# EAGLE design power electronics2 (EAGLE 9.2.2)
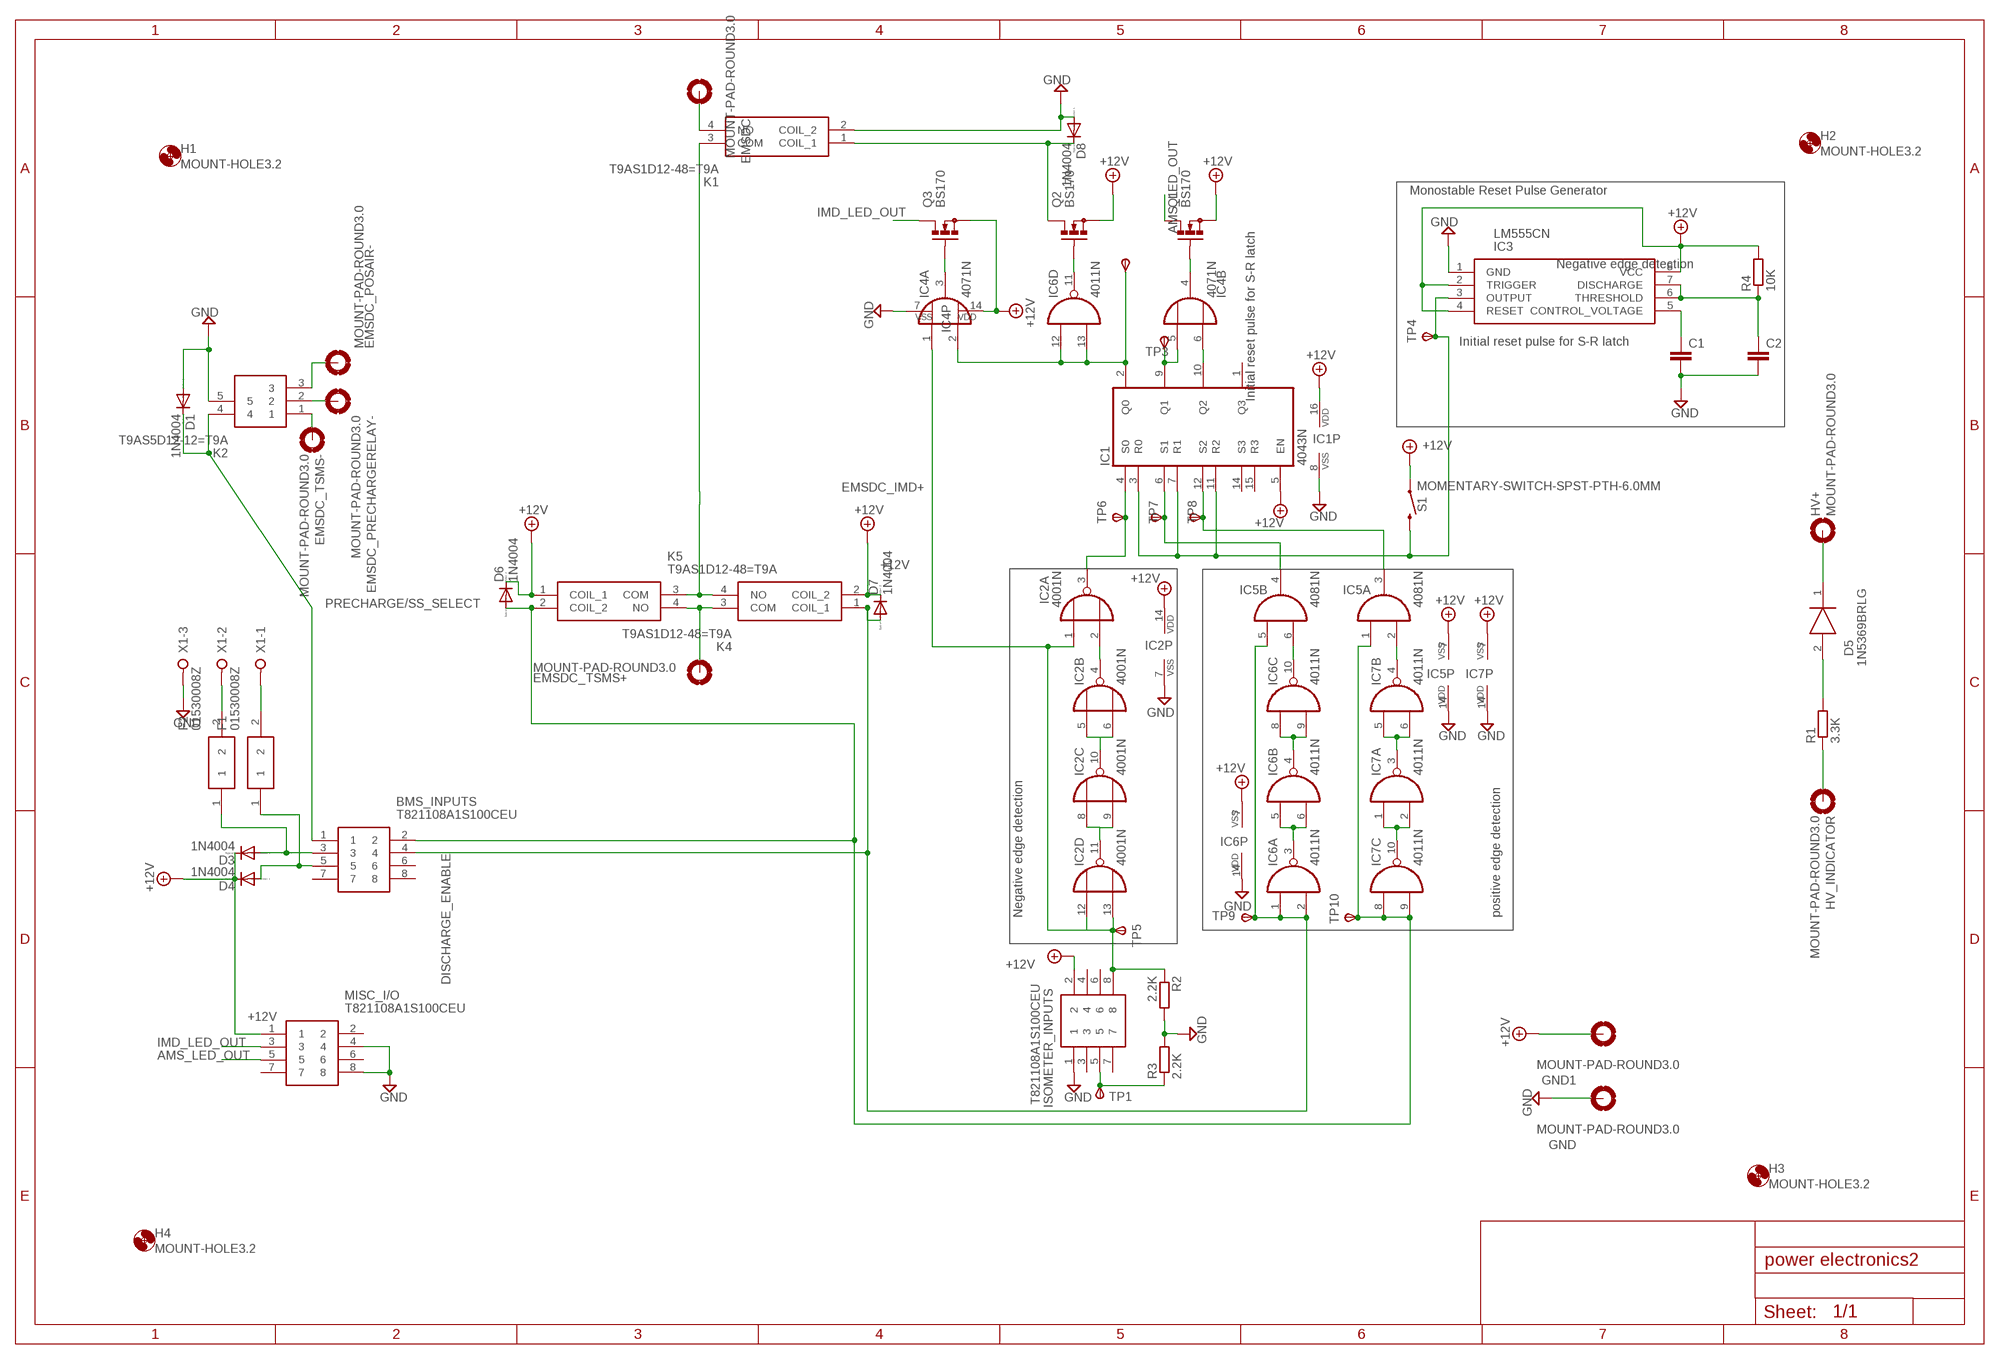
[diagram p0: schematic, sheet 1]

## Parts
BMS_INPUTS  T821108A1S100CEU  [HDRV8W64P254_2X4_1778X895X915P]
C1  C-EU050-024X044  [C050-024X044]
C2  C-EU050-024X044  [C050-024X044]
D1  1N4004  [DO41-10]
D3  1N4004  [DO41-10]
D4  1N4004  [DO41-10]
D5  1N5369BRLG  [DIOAD2260W109L864D349]
D6  1N4004  [DO41-10]
D7  1N4004  [DO41-10]
D8  1N4004  [DO41-10]
EMSDC  MOUNT-PAD-ROUND3.0  [3,0-PAD]
EMSDC_POSAIR-  MOUNT-PAD-ROUND3.0  [3,0-PAD]
EMSDC_PRECHARGERELAY-  MOUNT-PAD-ROUND3.0  [3,0-PAD]
EMSDC_TSMS+  MOUNT-PAD-ROUND3.0  [3,0-PAD]
EMSDC_TSMS-  MOUNT-PAD-ROUND3.0  [3,0-PAD]
F1  01530008Z  [01530008]
F2  01530008Z  [01530008]
GND  MOUNT-PAD-ROUND3.0  [3,0-PAD]
GND1  MOUNT-PAD-ROUND3.0  [3,0-PAD]
H1  MOUNT-HOLE3.2  [3,2]
H2  MOUNT-HOLE3.2  [3,2]
H3  MOUNT-HOLE3.2  [3,2]
H4  MOUNT-HOLE3.2  [3,2]
HV+  MOUNT-PAD-ROUND3.0  [3,0-PAD]
HV_INDICATOR  MOUNT-PAD-ROUND3.0  [3,0-PAD]
IC1  4043N  [DIL16]
IC2  4001N  [DIL14]
IC3  LM555CN  [DIP762W53P254L980H533Q8N]
IC4  4071N  [DIL14]
IC5  4081N  [DIL14]
IC6  4011N  [DIL14]
IC7  4011N  [DIL14]
ISOMETER_INPUTS  T821108A1S100CEU  [HDRV8W64P254_2X4_1778X895X915P]
K1  T9AS1D12-48=T9A  [T9AS1D1248T9A]
K2  T9AS5D12-12=T9A  [T9AS1D12]
K4  T9AS1D12-48=T9A  [T9AS1D1248T9A]
K5  T9AS1D12-48=T9A  [T9AS1D1248T9A]
MISC_I/O  T821108A1S100CEU  [HDRV8W64P254_2X4_1778X895X915P]
Q1  BS170  [SOT54E]
Q2  BS170  [SOT54E]
Q3  BS170  [SOT54E]
R1  3.3K  R-EU_0207/15  [0207/15]
R2  2.2K  R-EU_0207/12  [0207/12]
R3  2.2K  R-EU_0207/12  [0207/12]
R4  10K  R-EU_0207/15  [0207/15]
S1  MOMENTARY-SWITCH-SPST-PTH-6.0MM  [TACTILE_SWITCH_PTH_6.0MM]
TP1  TPSPAD1-17  [P1-17]
TP2  TPSPAD1-17  [P1-17]
TP3  TPSPAD1-17  [P1-17]
TP4  TPSPAD1-17  [P1-17]
TP5  TPSPAD1-17  [P1-17]
TP6  TPSPAD1-17  [P1-17]
TP7  TPSPAD1-17  [P1-17]
TP8  TPSPAD1-17  [P1-17]
TP9  TPSPAD1-17  [P1-17]
TP10  TPSPAD1-17  [P1-17]
X1  W237-3E  [W237-3E]

## Nets
+12V: D3.C D4.C D6.C D7.C GND1.B3,0(MOUNT) IC1.5(EN) IC1.16(VDD) IC2.14(P:VDD) IC3.2(TRIGGER) IC3.4(RESET) IC3.8(VCC) IC4.14(P:VDD) IC5.7(P:VSS) IC6.7(P:VSS) IC7.7(P:VSS) ISOMETER_INPUTS.2 K4.2(COIL_2) K5.1(COIL_1) MISC_I/O.1 Q1.S Q2.S Q3.S R4.2 S1.1
AMS_LED_OUT: MISC_I/O.5 Q1.D
CHG_SAFE: BMS_INPUTS.2 D6.A IC7.9(C:I1) K5.2(COIL_2)
DISCHARGE_ENABLE: BMS_INPUTS.4 D7.A IC5.5(B:I0) IC6.1(A:I0) IC6.2(A:I1) K4.1(COIL_1) TP9.TP(PP)
EMSDC_IMD+: K1.3(COM) K4.4(NO) K5.3(COM)
GND: C1.2 C2.2 D1.A D8.A GND.B3,0(MOUNT) IC1.8(VSS) IC2.7(P:VSS) IC3.1(GND) IC4.7(P:VSS) IC5.14(P:VDD) IC6.14(P:VDD) IC7.14(P:VDD) ISOMETER_INPUTS.1 K1.2(COIL_2) K2.5 MISC_I/O.4 MISC_I/O.8 R2.2 R3.2 X1.3
IMD_LED_OUT: MISC_I/O.3 Q3.D
N$1: EMSDC_TSMS-.B3,0(MOUNT) K2.1
N$2: EMSDC_POSAIR-.B3,0(MOUNT) K2.3
N$3: EMSDC_PRECHARGERELAY-.B3,0(MOUNT) K2.2
N$4: EMSDC_TSMS+.B3,0(MOUNT) K4.3(COM) K5.4(NO)
N$5: D5.1(K) HV+.B3,0(MOUNT)
N$6: BMS_INPUTS.3 D3.A F2.1
N$7: D5.2(A) R1.2
N$8: BMS_INPUTS.5 D4.A F1.1
N$9: HV_INDICATOR.B3,0(MOUNT) R1.1
N$10: ISOMETER_INPUTS.5 R3.1 TP1.TP(PP)
N$11: IC2.1(A:I0) IC2.12(D:I0) IC2.13(D:I1) IC4.1(A:I0) ISOMETER_INPUTS.8 R2.1 TP5.TP(PP)
N$12: IC2.8(C:I0) IC2.9(C:I1) IC2.11(D:O)
N$13: IC2.5(B:I0) IC2.6(B:I1) IC2.10(C:O)
N$14: IC2.2(A:I1) IC2.4(B:O)
N$15: D8.C K1.1(COIL_1) Q2.D
N$16: EMSDC.B3,0(MOUNT) K1.4(NO)
N$17: IC1.4(S0) IC2.3(A:O) TP6.TP(PP)
N$18: C2.1 IC3.6(THRESHOLD) IC3.7(DISCHARGE) R4.1
N$19: C1.1 IC3.5(CONTROL_VOLTAGE)
N$20: IC1.3(R0) IC1.7(R1) IC1.11(R2) IC3.3(OUTPUT) S1.3 TP4.TP(PP)
N$21: IC1.2(Q0) IC4.2(A:I1) IC6.12(D:I0) IC6.13(D:I1) TP2.TP(PP)
N$22: IC1.9(Q1) IC4.5(B:I0) TP3.TP(PP)
N$23: IC1.6(S1) IC5.4(B:O) TP7.TP(PP)
N$24: IC6.3(A:O) IC6.5(B:I0) IC6.6(B:I1)
N$25: IC6.4(B:O) IC6.8(C:I0) IC6.9(C:I1)
N$26: IC5.6(B:I1) IC6.10(C:O)
N$27: IC1.12(S2) IC5.3(A:O) TP8.TP(PP)
N$28: IC5.2(A:I1) IC7.4(B:O)
N$29: IC1.10(Q2) IC4.6(B:I1)
N$30: IC7.3(A:O) IC7.5(B:I0) IC7.6(B:I1)
N$31: F2.2 X1.2
N$32: IC7.1(A:I0) IC7.2(A:I1) IC7.10(C:O)
N$33: F1.2 X1.1
N$34: IC4.4(B:O) Q1.G
N$35: IC4.3(A:O) Q3.G
N$36: IC5.1(A:I0) IC7.8(C:I0) TP10.TP(PP)
N$37: IC6.11(D:O) Q2.G
PRECHARGE/SS_SELECT: BMS_INPUTS.1 D1.C K2.4
Unconnected: BMS_INPUTS.6 BMS_INPUTS.7 BMS_INPUTS.8 IC1.1(Q3) IC1.14(S3) IC1.15(R3) IC4.8(C:I0) IC4.9(C:I1) IC4.10(C:O) IC4.11(D:O) IC4.12(D:I0) IC4.13(D:I1) IC5.8(C:I0) IC5.9(C:I1) IC5.10(C:O) IC5.11(D:O) IC5.12(D:I0) IC5.13(D:I1) IC7.11(D:O) IC7.12(D:I0) IC7.13(D:I1) ISOMETER_INPUTS.3 ISOMETER_INPUTS.4 ISOMETER_INPUTS.6 ISOMETER_INPUTS.7 MISC_I/O.2 MISC_I/O.6 MISC_I/O.7

## Notes on the sheet
- Monostable Reset Pulse Generator
- Negative edge detection
- Initial reset pulse for S-R latch
- Initial reset pulse for S-R latch
- Negative edge detection | positive edge detection

## Library data of the parts
BMS_INPUTS ISOMETER_INPUTS MISC_I/O = SamacSys_Parts:T821108A1S100CEU: HEADER, VERTICAL, 2.54MM, 8WAY Amphenol T821 Series, 2.54mm Pitch 8 Way 2 Row Straight PCB Header, Solder Termination, 3A Source: Datasheet <http://uk.rs-online.com/web/p/products/8323569>; DESCRIPTION: HEADER, VERTICAL, 2.54MM, 8WAY Amphenol T821 Series, 2.54mm Pitch 8 Way 2 Row Straight PCB Header, Solder Termination, 3A; HEIGHT: 9.15mm; MANUFACTURER_NAME: Amphenol; MANUFACTURER_PART_NUMBER: T821108A1S100CEU; RS_PART_NUMBER: 8323569; RS_PRICE-STOCK: http://uk.rs-online.com/web/p/products/8323569
C1 C2 = rcl:C-EU: CAPACITOR, European symbol; SPICEPREFIX: C
D1 D3 D4 D6-D8 = diode:1N4004: DIODE general purpose rectifier, 1 A
D5 = SamacSys_Parts:1N5369BRLG: Zener Diode, 51V 5% 5 W Through Hole 2-pin DO-15 Source: Datasheet <http://uk.rs-online.com/web/p/products/6547678P>; ALLIED_NUMBER: 70339233; DESCRIPTION: Zener Diode, 51V 5% 5 W Through Hole 2-pin DO-15; HEIGHT: mm; MANUFACTURER_NAME: ON Semiconductor; MANUFACTURER_PART_NUMBER: 1N5369BRLG; RS_PART_NUMBER: 6547678P; RS_PRICE-STOCK: http://uk.rs-online.com/web/p/products/6547678P
EMSDC EMSDC_POSAIR- EMSDC_PRECHARGERELAY- EMSDC_TSMS+ EMSDC_TSMS- GND GND1 HV+ HV_INDICATOR = holes:MOUNT-PAD-ROUND: MOUNTING PAD, round
F1 F2 = SamacSys_Parts:01530008Z: Mini fuseholder,15A 32V Littelfuse 15A PCB Mount Fuse Holder Automotive Fuse, 32 V Source: Datasheet <http://www.littelfuse.com/data/en/data_sheets/153_pcmount.pdf>; ALLIED_NUMBER: 70184304; DESCRIPTION: Mini fuseholder,15A 32V Littelfuse 15A PCB Mount Fuse Holder Automotive Fuse, 32 V; HEIGHT: mm; MANUFACTURER_NAME: LITTELFUSE; MANUFACTURER_PART_NUMBER: 01530008Z; RS_PART_NUMBER: 3607317; RS_PRICE-STOCK: https://uk.rs-online.com/web/p/products/3607317
H1-H4 = holes:MOUNT-HOLE: MOUNTING HOLE with drill center marker
IC1 = 40xx:4043: Quad 3-state NOR R/S LATCH
IC2 = 40xx:4001: Quad 2-input NOR
IC3 = SamacSys_Parts:LM555CN: ON Semiconductor LM555CN, Timer, 4.5 16 V, 8-Pin PDIP Source: Datasheet <https://www.mouser.com/datasheet/2/308/LM555-1124984.pdf>; DESCRIPTION: ON Semiconductor LM555CN, Timer, 4.5 16 V, 8-Pin PDIP; HEIGHT: 5.33mm; MANUFACTURER_NAME: ON Semiconductor; MANUFACTURER_PART_NUMBER: LM555CN; MOUSER_PART_NUMBER: 512-LM555CN
IC4 = 40xx:4071: Quad 2-input OR
IC5 = 40xx:4081: Quad 2-input AND
IC6 IC7 = 40xx:4011: Quad 2-input NAND
K1 K4 K5 = SamacSys_Parts:T9AS1D12-48=T9A: SPST-NO PCB Mount Non-Latching Relay Through Hole, 48V dc Source: Datasheet <http://uk.rs-online.com/web/p/products/6802534P>; DESCRIPTION: SPST-NO PCB Mount Non-Latching Relay Through Hole, 48V dc; HEIGHT: 20.4mm; MANUFACTURER_NAME: TE Connectivity; MANUFACTURER_PART_NUMBER: T9AS1D12-48=T9A; RS_PART_NUMBER: 6802534P; RS_PRICE-STOCK: http://uk.rs-online.com/web/p/products/6802534P
K2 = SamacSys_Parts:T9AS5D12-12=T9A: PCB Relay SPDT 30A 12Vdc,thru hole SPDT PCB Mount Non-Latching Relay Through Hole, 12V dc Source: Datasheet; ALLIED_NUMBER: R1111589; DESCRIPTION: PCB Relay SPDT 30A 12Vdc,thru hole SPDT PCB Mount Non-Latching Relay Through Hole, 12V dc; HEIGHT: mm; MANUFACTURER_NAME: TE Connectivity; MANUFACTURER_PART_NUMBER: T9AS5D12-12=T9A; RS_PART_NUMBER: 6802528; RS_PRICE-STOCK: https://uk.rs-online.com/web/p/products/6802528
Q1-Q3 = transistor-small-signal:BS170: N-CHANNEL MOS FET
R1-R4 = rcl:R-EU_: RESISTOR, European symbol; SPICEPREFIX: R
S1 = SparkFun-Switches:MOMENTARY-SWITCH-SPST: Momentary Switch (Pushbutton) - SPST Normally-open (NO) SPST momentary switches (buttons, pushbuttons). Variants PTH-12MM - 12mm square, through-hole Momentary Pushbutton Switch - 12mm Square <https://www.sparkfun.com/products/9190> (COM-09190) PTH-6.0MM, PTH-6.0MM-KIT - 6.0mm square, through-hole Mini Pushbutton Switch <https://www.sparkfun.com/products/97> (COM-00097) KIT package intended for soldering kit's - only one side of pads' copper is exposed. PTH-RIGHT-ANGLE-KIT - Right-angle, through-hole Right Angle Tactile Button <https://www.sparkfun.com/products/10791> - Used on SparkFun BigTime Watch Kit <https://www.sparkfun.com/products/11734> SMD-12MM - 12mm square, surface-mount Tactile Button - SMD (12mm) <https://www.sparkfun.com/products/12993> (COM-12993) Used on SparkFun PicoBoard <https://www.sparkfun.com/products/11888> SMD-4.5MM - 4.5mm Square Trackball Switch Used on SparkFun Blackberry Trackballer Breakout <https://www.sparkfun.com/products/13169> SMD-4.6MMX2.8MM - 4.60mm x 2.80mm, surface mount Used on SparkFun SAMD21 Mini Breakout <https://www.sparkfun.com/products/13664> SMD-5.2MM, SMD-5.2-REDUNDANT - 5.2mm square, surface-mount Mini Pushbutton Switch - SMD <https://www.sparkfun.com/products/8720> (COM-08720) Used on Arduino Pro Mini <https://www.sparkfun.com/products/11114> REDUNDANT package connects both switch circuits together SMD-6.0X3.5MM - 6.0 x 3.5mm, surface mount Momentary Reset Switch SMD <https://www.sparkfun.com/products/8229> (COM-08229) SMD-6.2MM-TALL - 6.2mm square, surface mount Tactile Button - SMD (6mm) <https://www.sparkfun.com/products/12992> Used on SparkFun Digital Sandbox <https://www.sparkfun.com/products/12651> SMD-RIGHT-ANGLE - Right-angle, surface mount Used on SparkFun Block for Intel® Edison - Arduino <https://www.sparkfun.com/products/13036>; PROD_ID: SWCH-08441; SF_SKU: COM-00097
TP1-TP10 = testpad:TPS: TEST PIN
X1 = con-wago-508:W237-3E: WAGO SREW CLAMP; OC_FARNELL: unknown; OC_NEWARK: unknown

## Board
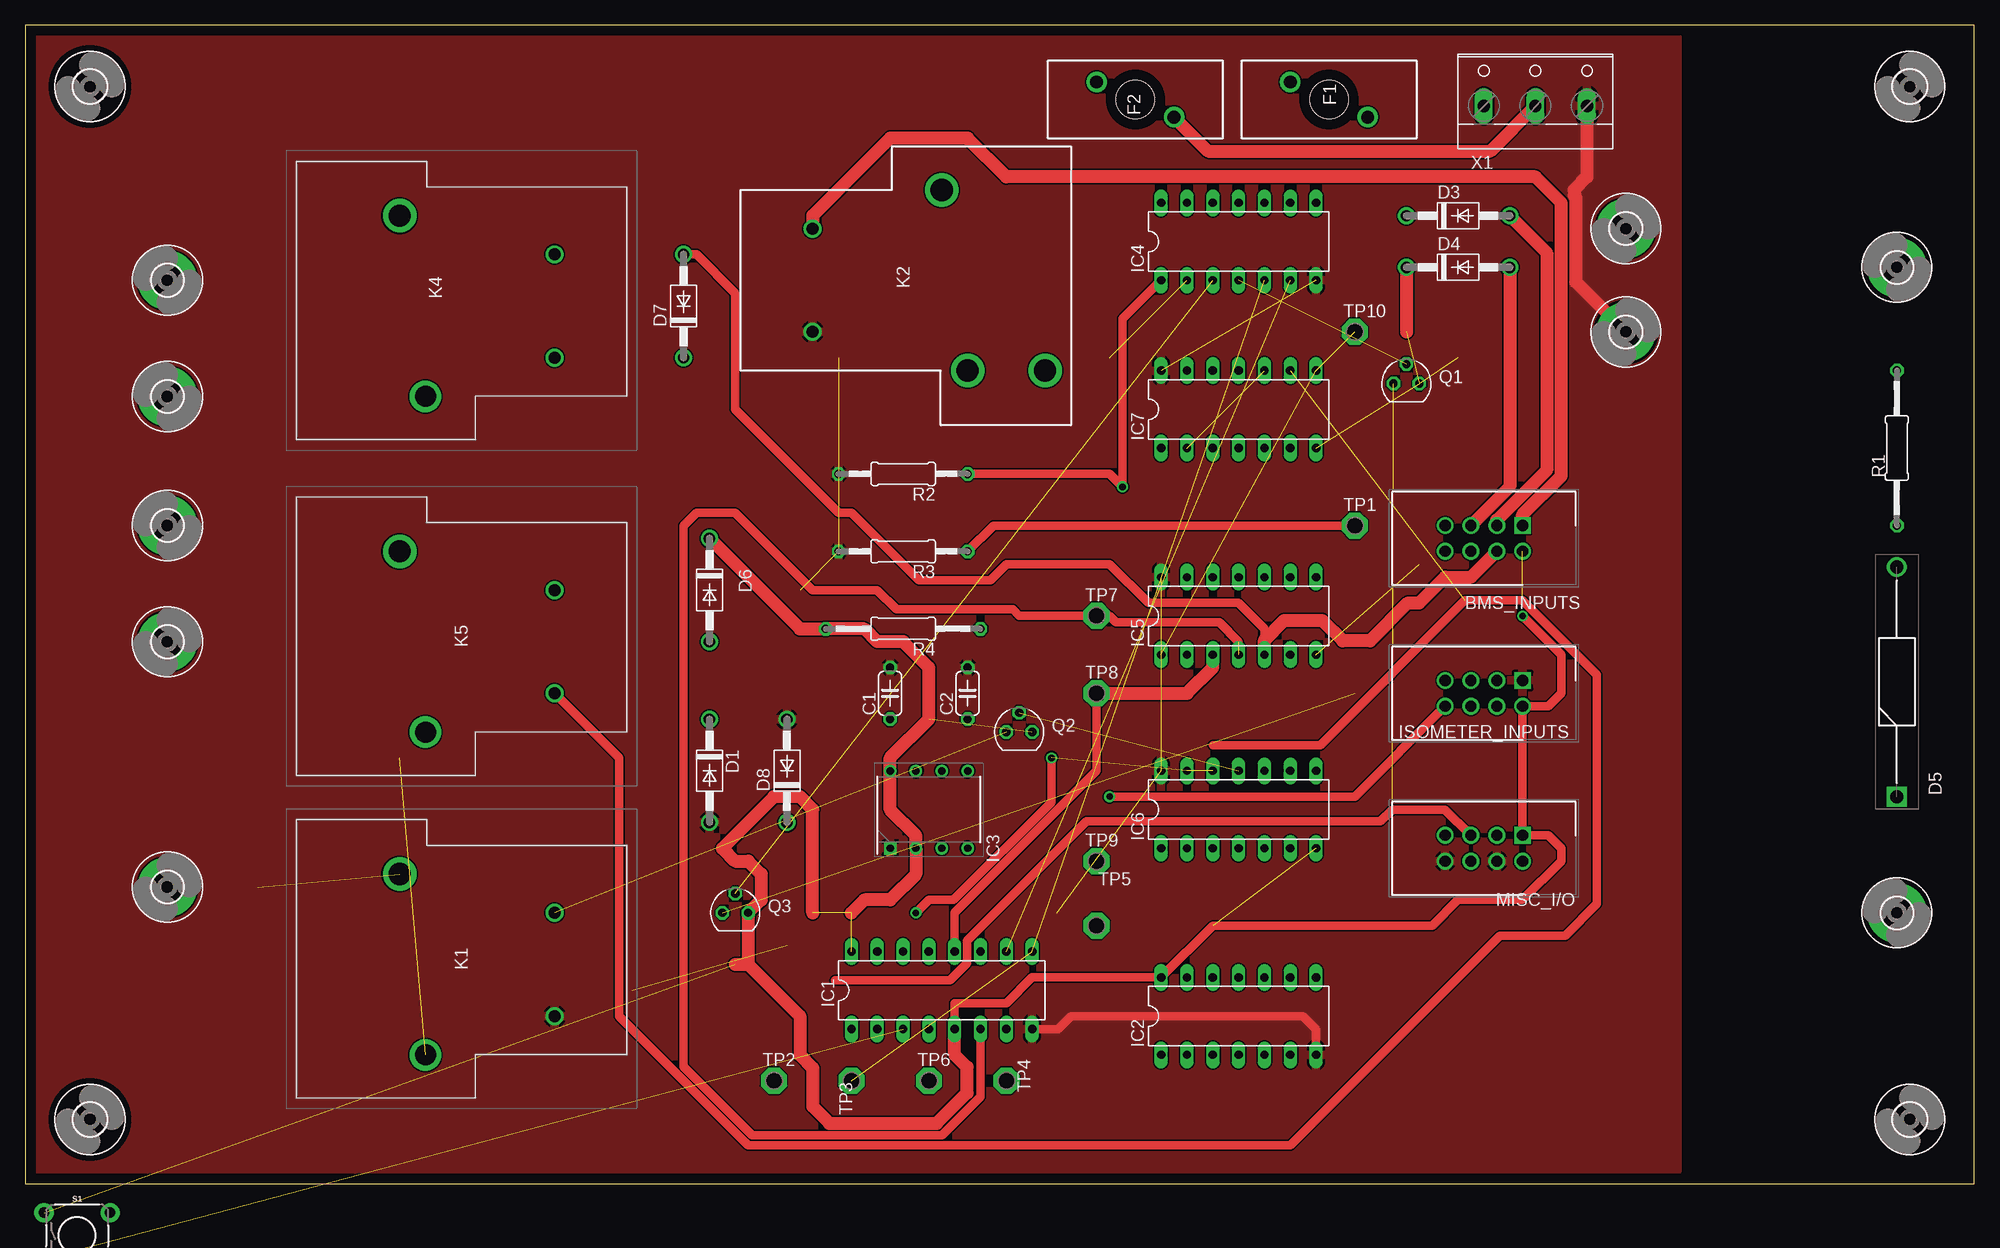
[diagram p1: board, top side]
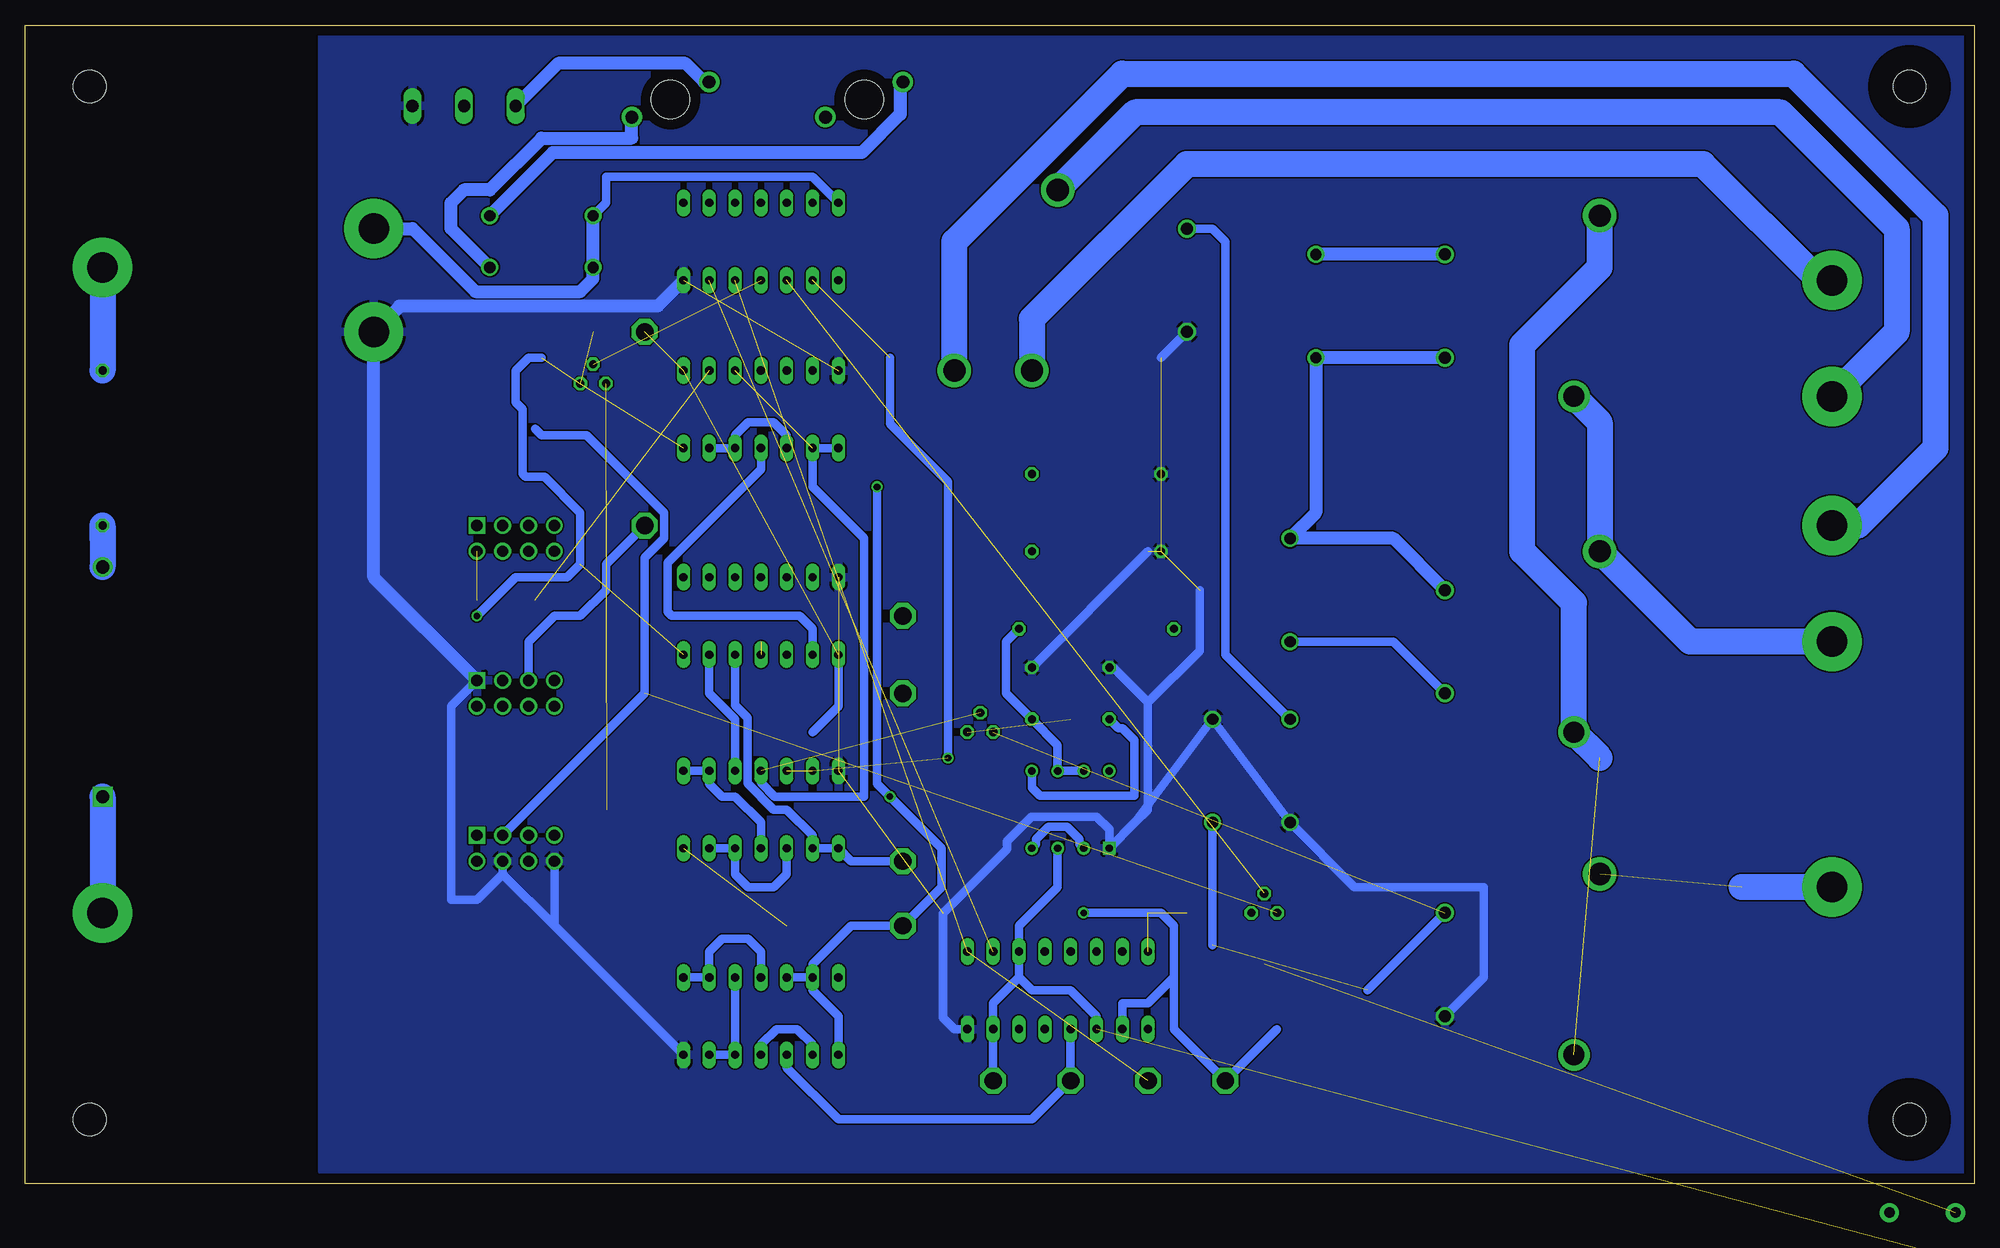
[diagram p2: board, bottom side, seen from below]

Size 191.75 x 113.97 mm. Coordinates in mm from the lower left corner, seen from the top.
Outline: 0,0 191.75,0 191.75,113.97 0,113.97 0,0
Copper layers (1*16): Top 0.035mm / dielectric 1.5mm / Bottom 0.035mm
Design rules "default": minimum track width 6mil, minimum drill 0.35mm, track to track 6mil, track to pad 6mil, pad to pad 6mil, via to via 6mil, smd to smd 6mil, copper to edge 40mil, drill to drill 6mil, minimum pad ring 10mil, minimum via ring 8mil, stop-mask expansion 4mil, vias tented up to drill 0mil, thermal gap 10mil

### Footprints (pad centres in the part's own frame; a part is rotated, then mirrored left to right if it is on the bottom)
HDRV8W64P254_2X4_1778X895X915P = drill 1.1 pad 1.65 square: 1 0,0 | drill 1.1 pad 1.65: 2 0,2.54; 3 2.54,0; 4 2.54,2.54; 5 5.08,0; 6 5.08,2.54; 7 7.62,0; 8 7.62,2.54
C050-024X044 = drill 0.813 octagon: 1 -2.54,0; 2 2.54,0
DO41-10 = drill 1.118: A 5.08,0; C -5.08,0
DIOAD2260W109L864D349 = drill 1.3 pad 1.95 square: 1 0,0 | drill 1.3 pad 1.95: 2 22.6,0
3,0-PAD = drill 3 pad 5.842: B3,0 0,0
01530008 = drill 1.27 pad 2: 1 1.727,3.81; 2 -1.727,-3.81 | hole 3.785: 0,0
3,2 = hole 3.2: 0,0
DIL16 = drill 0.813 long: 1 -8.89,-3.81; 2 -6.35,-3.81; 3 -3.81,-3.81; 4 -1.27,-3.81; 5 1.27,-3.81; 6 3.81,-3.81; 7 6.35,-3.81; 8 8.89,-3.81; 9 8.89,3.81; 10 6.35,3.81; 11 3.81,3.81; 12 1.27,3.81; 13 -1.27,3.81; 14 -3.81,3.81; 15 -6.35,3.81; 16 -8.89,3.81
DIL14 = drill 0.813 long: 1 -7.62,-3.81; 2 -5.08,-3.81; 3 -2.54,-3.81; 4 0,-3.81; 5 2.54,-3.81; 6 5.08,-3.81; 7 7.62,-3.81; 8 7.62,3.81; 9 5.08,3.81; 10 2.54,3.81; 11 0,3.81; 12 -2.54,3.81; 13 -5.08,3.81; 14 -7.62,3.81
DIP762W53P254L980H533Q8N = drill 0.73 pad 1.13 square: 1 -3.81,3.81 | drill 0.73 pad 1.13: 2 -3.81,1.27; 3 -3.81,-1.27; 4 -3.81,-3.81; 5 3.81,-3.81; 6 3.81,-1.27; 7 3.81,1.27; 8 3.81,3.81
T9AS1D1248T9A = drill 1.17 pad 1.755: 1 0,0; 2 -10.16,0 | drill 2.06 pad 3.09: 3 -13.97,12.7 | drill 2.19 pad 3.3: 4 3.81,15.24
T9AS1D12 = drill 2.19 pad 3.29: 1 -8.89,12.7; 2 8.89,15.24; 3 8.89,22.86 | drill 1.17 pad 1.77: 4 -5.08,0; 5 5.08,0
SOT54E = drill 0.813 octagon: D -1.27,0; G 0,1.905; S 1.27,0
0207/15 = drill 0.813 octagon: 1 -7.62,0; 2 7.62,0
0207/12 = drill 0.813 octagon: 1 -6.35,0; 2 6.35,0
TACTILE_SWITCH_PTH_6.0MM = drill 1.016 pad 1.88: 1 -3.251,2.261; 2 3.251,2.261; 3 -3.251,-2.261; 4 3.251,-2.261
P1-17 = drill 1.702 pad 2.54 octagon: TP 0,0
W237-3E = drill 1.194 long: 1 -5.08,-0.635; 2 0,-0.635; 3 5.08,-0.635

### Placement (x,y rotation side)
BMS_INPUTS  147.32,64.77 180 top
C1  85.09,48.26 90 top
C2  92.71,48.26 90 top
D1  67.31,40.64 270 top
D3  140.97,95.25 0 top
D4  140.97,90.17 0 top
D5  184.15,38.1 90 top
D6  67.31,58.42 270 top
D7  64.77,86.36 90 top
D8  74.93,40.64 90 top
EMSDC  13.97,29.21 0 top
EMSDC_POSAIR-  13.97,64.77 270 top
EMSDC_PRECHARGERELAY-  13.97,88.9 270 top
EMSDC_TSMS+  13.97,53.34 0 top
EMSDC_TSMS-  13.97,77.47 270 top
F1  128.27,106.68 270 top
F2  109.22,106.68 90 top
GND  157.48,83.82 0 top
GND1  157.48,93.98 0 top
H1  185.42,6.35 0 top
H2  185.42,107.95 0 top
H3  6.35,6.35 0 top
H4  6.35,107.95 0 top
HV+  184.15,26.67 270 top
HV_INDICATOR  184.15,90.17 90 top
IC1  90.17,19.05 0 top
IC2  119.38,16.51 0 top
IC3  88.9,36.83 90 top
IC4  119.38,92.71 0 top
IC5  119.38,55.88 0 top
IC6  119.38,36.83 0 top
IC7  119.38,76.2 0 top
ISOMETER_INPUTS  147.32,49.53 180 top
K1  52.07,26.67 90 top
K2  77.47,88.9 270 top
K4  52.07,91.44 90 top
K5  52.07,58.42 90 top
MISC_I/O  147.32,34.29 180 top
Q1  135.89,78.74 0 top
Q2  97.79,44.45 0 top
Q3  69.85,26.67 0 top
R1  184.15,72.39 270 top
R2  86.36,69.85 180 top
R3  86.36,62.23 180 top
R4  86.36,54.61 180 top
S1  5.08,-5.08 0 top
TP1  130.81,64.77 0 top
TP2  73.66,10.16 0 top
TP3  81.28,10.16 270 top
TP4  96.52,10.16 90 top
TP5  105.41,25.4 0 top
TP6  88.9,10.16 0 top
TP7  105.41,55.88 0 top
TP8  105.41,48.26 0 top
TP9  105.41,31.75 0 top
TP10  130.81,83.82 0 top
X1  148.59,106.68 0 top

### Tracks (layer width: path | path; a pad name or v marks a point on that pad's centre or on a via)
+12V  (via drill 0.65)  (9 unrouted)
  Top 0.813: v147.32,55.88 151.13,52.07 151.13,48.26 149.86,46.99 ISOMETER_INPUTS.2 MISC_I/O.1 149.86,34.29 151.13,33.02 151.13,31.75 147.32,27.94 140.97,27.94 138.43,25.4 116.84,25.4 IC2.14 99.06,20.32 96.52,17.78 91.44,17.78 IC1.5
  Top 1.27: D4.C 135.89,83.82 | 77.47,26.67 77.47,36.83 76.2,38.1 73.66,38.1 68.58,33.02 69.85,31.75 71.12,31.75 72.39,30.48 72.39,27.94 Q3.S 71.12,21.59 | 81.28,26.67 82.55,27.94 85.09,27.94 87.63,30.48 IC3.2 87.63,34.29 85.09,36.83 IC3.8 85.09,41.91 88.9,45.72 88.9,50.8 86.36,53.34 83.82,53.34 82.55,54.61 R4.2 76.2,54.61 D6.C | 69.85,21.59 71.12,21.59 | 71.12,21.59 76.2,16.51 76.2,12.7 77.47,11.43 77.47,7.62 79.12,5.97 89.68,5.97 92.65,8.95 92.65,11.49 91.44,12.7 IC1.5
  Bottom 0.813: IC3.2 88.03,33.42 88.03,33.91 89.28,35.16 91.06,35.16 92.31,33.91 92.31,33.42 IC3.4 | IC4.14 114.3,99.06 134.62,99.06 134.62,96.52 D3.C | 140.97,81.28 142.24,81.28 143.51,80.01 143.51,76.89 142.82,76.2 142.82,69.85 142.53,69.56 140.68,69.56 137.16,66.04 137.16,60.96 138.43,59.69 143.51,59.69 v147.32,55.88
  Bottom 1.27: K5.1 57.15,63.5 D6.C 64.77,66.04 D7.C K4.2 | GND1.B3,0 153.67,93.98 147.47,87.78 137.16,87.78 135.89,89.05 D4.C D3.C
AMS_LED_OUT  (1 unrouted)
  Top 0.813: 79.68,20.02 90.98,20.02 92.66,21.7 92.66,23.92 104.41,35.67 133.35,35.67 134.51,36.83 139.7,36.83 MISC_I/O.5
CHG_SAFE  (2 unrouted)
  Top 0.813: K5.2 58.42,41.91 58.42,16.51 71.12,3.81 124.46,3.81 145.09,24.43 151.53,24.43 154.63,27.54 154.63,50.1 147.32,57.42 141.66,57.42 127.42,43.18 116.84,43.18
  Bottom 0.813: K5.2 57.15,53.34 D6.A
DISCHARGE_ENABLE
  Top 0.813: D7.A 66.04,91.44 69.85,87.63 69.85,76.2 80.01,66.04 81.28,66.04 87.94,59.38 94.94,59.38 96.52,60.96 106.68,60.96 110.49,57.15 119.38,57.15 121.92,54.61 IC5.5
  Top 1.27: BMS_INPUTS.4 142.24,59.69 139.7,59.69 137.16,57.15 136.06,57.15 132.33,53.42 129.62,53.42 127.6,55.45 123.86,55.45 121.92,53.51 IC5.5
  Bottom 0.813: TP9.TP 110.49,31.75 IC6.1 IC6.2 114.3,34.29 116.84,36.83 118.11,36.83 120.7,39.42 120.7,45.87 121.92,47.09 IC5.5
  Bottom 1.27: K4.1 D7.A
EMSDC_IMD+  (1 unrouted)
  Bottom 2.54: 36.83,41.91 K5.3 39.37,57.15 44.45,62.23 44.45,82.55 36.83,90.17 K4.4
GND  (7 unrouted)
  Top 0.813: IC1.8 101.6,15.24 102.87,16.51 125.73,16.51 127,15.24 IC2.7
  Top 1.27: X1.3 153.67,99.06 152.4,97.79 152.4,97.26 152.55,97.11 152.55,88.75 GND.B3,0
  Bottom 0.813: K1.2 48.26,20.32 48.26,29.21 60.96,29.21 D1.A D8.A 82.55,35.56 | 82.55,35.56 81.28,36.83 81.28,47.39 | 82.55,35.56 IC3.1 85.09,34.88 86.34,36.13 92.73,36.13 95.16,33.7 95.16,32.92 101.44,26.64 101.44,16.36 100.33,15.24 IC1.8 | C1.2 84.69,50.8 81.28,47.39 | IC2.7 139.7,25.4 | 139.7,25.4 MISC_I/O.8 | 139.7,25.4 144.78,30.48 | 144.78,30.48 MISC_I/O.4 | ISOMETER_INPUTS.1 149.86,46.99 149.86,27.94 147.32,27.94 144.78,30.48 | K2.5 80.01,81.28 | 81.28,47.39 76.2,52.47 76.2,58.42 | C2.2 81.28,62.23
  Bottom 1.27: IC4.7 129.54,86.36 154.94,86.36 GND.B3,0 157.48,59.69 ISOMETER_INPUTS.1
  pour Bottom: 1.27,113.03 162.56,113.03 162.56,1.27 1.27,1.27
  pour Top: 1.27,1.27 162.56,1.27 162.56,113.03 1.27,113.03
IMD_LED_OUT  (1 unrouted)
  Bottom 0.813: MISC_I/O.3 130.81,48.26 130.81,61.59 128.91,63.5 128.91,66.04 136.53,73.66 140.97,73.66 141.6,74.3
N$1
  Bottom 2.54: EMSDC_TSMS-.B3,0 7.62,83.82 7.62,93.98 19.05,105.41 82.55,105.41 K2.1
N$2
  Bottom 2.54: K2.3 100.33,92.71 83.82,109.22 17.78,109.22 3.81,95.25 3.81,72.39 11.43,64.77 EMSDC_POSAIR-.B3,0
N$3
  Bottom 2.54: EMSDC_PRECHARGERELAY-.B3,0 15.24,88.9 26.67,100.33 77.47,100.33 92.71,85.09 K2.2
N$4
  Bottom 2.54: K4.3 36.83,74.93 K5.4 27.94,53.34 EMSDC_TSMS+.B3,0
N$5
  Bottom 2.54: D5.1 HV+.B3,0
N$6
  Top 1.27: BMS_INPUTS.3 144.78,65.3 149.71,70.23 149.71,91.59 D3.A
  Bottom 1.27: F2.1 105.68,108.14 105.68,105.21 109.44,101.45 139.85,101.45 D3.A
N$7
  Bottom 2.54: 184.15,63.5 R1.2 D5.2
N$8
  Top 1.27: D4.A 146.05,68.58 BMS_INPUTS.5
  Bottom 1.27: D4.A 149.86,93.98 149.86,96.52 148.59,97.79 146.05,97.79 140.97,102.87 132.08,102.87 F1.1
N$9
  Bottom 2.54: HV_INDICATOR.B3,0 R1.1
N$10
  Top 0.813: R3.1 95.25,64.77 TP1.TP
  Bottom 0.813: TP1.TP 134.62,60.96 134.62,58.42 137.16,55.88 139.7,55.88 142.24,53.34 ISOMETER_INPUTS.5
N$11  (via drill 0.65)
  Top 0.813: ISOMETER_INPUTS.8 130.81,38.1 v106.68,38.1 | R2.1 106.68,69.85 v107.95,68.58 107.95,85.09 IC4.1
  Bottom 0.813: IC2.13 IC2.12 | IC2.13 114.3,21.59 110.49,25.4 TP5.TP 101.6,29.21 101.6,33.02 v106.68,38.1 107.95,39.37 v107.95,68.58 | IC2.13 114.3,19.05 111.76,16.51 IC2.1
N$12
  Bottom 0.813: IC2.8 IC2.9 124.46,22.86 123.19,24.13 120.65,24.13 119.38,22.86 IC2.11
N$13
  Bottom 0.813: IC2.10 IC2.5 IC2.6
N$14
  Bottom 0.813: IC2.2 114.3,13.72 115.82,15.24 117.86,15.24 119.38,13.72 IC2.4
N$15  (2 unrouted)
  Bottom 0.813: K1.1 59.69,19.05 | D8.C 74.93,23.5
N$16  (1 unrouted)
  Bottom 2.54: EMSDC.B3,0 22.86,29.21
N$17
  Bottom 0.813: IC1.4 TP6.TP 92.71,6.35 111.76,6.35 116.84,11.43 IC2.3
N$18
  Bottom 0.813: IC3.7 IC3.6 90.17,43.18 C2.1 95.25,48.26 95.25,53.34 R4.1
N$19
  Bottom 0.813: C1.1 84.22,44.85 83.82,44.85 82.64,43.67 82.64,38.19 91.93,38.19 92.71,38.97 IC3.5
N$20  (1 unrouted)
  Bottom 0.813: IC3.3 90.17,29.21 93.98,25.4 IC1.11 93.98,20.32 | TP4.TP IC1.7 96.52,17.78 93.98,20.32 | IC1.3 86.36,16.51 88.9,19.05 92.71,19.05 93.98,20.32
N$21  (via drill 0.65)  (3 unrouted)
  Top 0.813: v87.63,26.67 88.9,27.94 91.34,27.94 100.97,37.56 v100.97,41.91
  Bottom 0.813: 68.58,15.24 TP2.TP 78.74,15.24 78.74,20.32 | 106.68,81.28 106.68,74.78 100.97,69.06 v100.97,41.91 | v87.63,26.67 80.01,26.67 78.74,25.4 78.74,20.32 | IC1.2 83.82,17.78 81.28,17.78 78.74,20.32
N$22  (2 unrouted)
N$23  (1 unrouted)
  Top 0.813: IC1.6 93.98,8.59 90.17,4.78 71.52,4.78 64.77,11.53 64.77,64.77 66.04,66.04 69.85,66.04 77.47,58.42 83.82,58.42 85.72,56.52 97.16,56.52 97.79,55.88 TP7.TP 106.68,55.88 107.31,55.24 117.47,55.24 119.38,53.34
N$24
  Bottom 0.813: IC6.3 116.84,30.48 118.11,29.21 120.65,29.21 121.92,30.48 IC6.5 IC6.6
N$25
  Bottom 0.813: IC6.8 IC6.9 124.46,39.37 123.19,38.1 121.92,38.1 119.38,35.56 IC6.4
N$26
  Bottom 0.813: IC5.6 124.46,48.26 121.92,45.72 IC6.10
N$27
  Top 0.813: IC1.12 91.44,26.67 105.41,40.64 TP8.TP
  Top 1.27: TP8.TP 114.3,48.26 116.84,50.8 IC5.3
N$28
  Bottom 0.813: IC5.2 114.3,54.61 115.57,55.88 128.18,55.88 128.57,56.28 128.57,61.1 119.38,70.3 IC7.4
N$29  (1 unrouted)
N$30
  Bottom 0.813: IC7.6 IC7.5 121.92,73.66 120.65,74.93 118.11,74.93 116.84,73.66 IC7.3
N$31
  Top 1.27: F2.2 116.38,101.6 144.15,101.6 X1.2
N$32  (1 unrouted)
  Bottom 0.813: IC7.1 IC7.2 114.3,68.58 109.22,63.5 109.22,38.1 118.02,38.1 119.38,39.47
N$33
  Bottom 1.27: F1.2 124.99,108.41 126.8,110.22 139.33,110.22 X1.1
N$34  (1 unrouted)
N$35  (1 unrouted)
N$36  (2 unrouted)
  Bottom 0.813: IC5.1 111.76,46.99 114.3,44.45
N$37  (1 unrouted)
PRECHARGE/SS_SELECT
  Top 1.27: BMS_INPUTS.1 147.32,65.83 151.13,69.64 151.13,96.52 148.59,99.06 96.52,99.06 92.71,102.87 85.09,102.87 77.47,95.25 K2.4
  Bottom 0.813: D1.C 73.66,52.07 73.66,92.71 74.93,93.98 K2.4